# EAGLE design active-multiples (EAGLE 9.2.2)
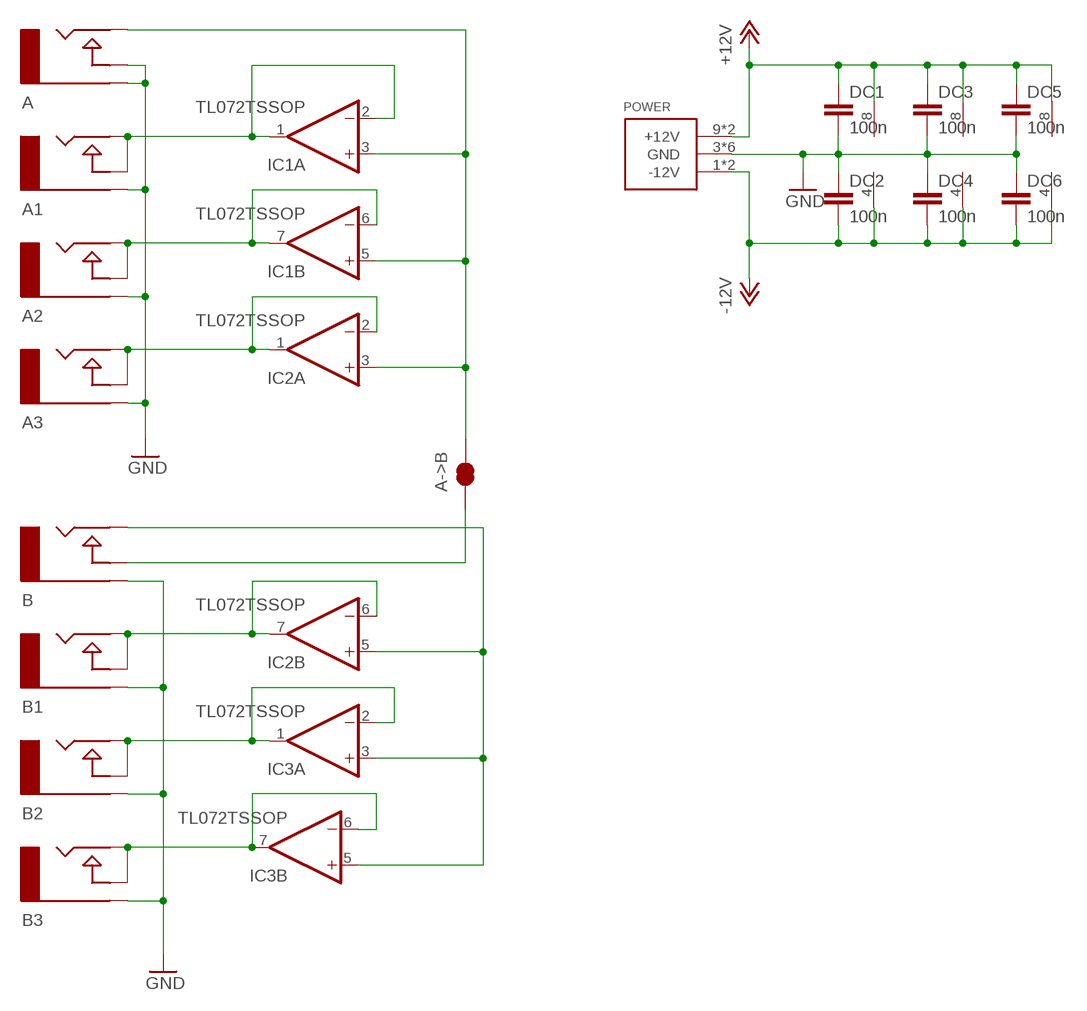
[diagram p0: schematic, sheet 1]

## Parts
A  AUDIO-JACKINLINE  [ERTHENVAR-JACK-INLINE]
A1  AUDIO-JACKINLINE  [ERTHENVAR-JACK-INLINE]
A2  AUDIO-JACKINLINE  [ERTHENVAR-JACK-INLINE]
A3  AUDIO-JACKINLINE  [ERTHENVAR-JACK-INLINE]
A->B  JUMPER-PAD-2-NC_BY_TRACENO_SILK  [PAD-JUMPER-2-NC_BY_TRACE_NO_SILK]
B  AUDIO-JACKINLINE  [ERTHENVAR-JACK-INLINE]
B1  AUDIO-JACKINLINE  [ERTHENVAR-JACK-INLINE]
B2  AUDIO-JACKINLINE  [ERTHENVAR-JACK-INLINE]
B3  AUDIO-JACKINLINE  [ERTHENVAR-JACK-INLINE]
DC1  100n  CAP0603-CAP  [0603-CAP]
DC2  100n  CAP0603-CAP  [0603-CAP]
DC3  100n  CAP0603-CAP  [0603-CAP]
DC4  100n  CAP0603-CAP  [0603-CAP]
DC5  100n  CAP0603-CAP  [0603-CAP]
DC6  100n  CAP0603-CAP  [0603-CAP]
IC1  TL072TSSOP  [TSSOP8]
IC2  TL072TSSOP  [TSSOP8]
IC3  TL072TSSOP  [TSSOP8]
POWER  POWER_SIMPLE10  [POWER_10]

## Nets
+12V: DC1.1 DC3.1 DC5.1 IC1.8(P:V+) IC2.8(P:V+) IC3.8(P:V+) POWER.9(+12V) POWER.10(+12V)
-12V: DC2.2 DC4.2 DC6.2 IC1.4(P:V-) IC2.4(P:V-) IC3.4(P:V-) POWER.1(-12V) POWER.2(-12V)
GND: A1.G(RING) A2.G(RING) A3.G(RING) A.G(RING) A.N(NORM) B1.G(RING) B2.G(RING) B3.G(RING) B.G(RING) DC1.2 DC2.1 DC3.2 DC4.1 DC5.2 DC6.1 POWER.3(GND) POWER.4(GND) POWER.5(GND) POWER.6(GND) POWER.7(GND) POWER.8(GND)
N$1: A1.N(NORM) A1.T(TIP) IC1.1(A:OUT) IC1.2(A:-IN)
N$2: A->B.1 B.N(NORM)
N$3: A3.N(NORM) A3.T(TIP) IC2.1(A:OUT) IC2.2(A:-IN)
N$4: A2.N(NORM) A2.T(TIP) IC1.6(B:-IN) IC1.7(B:OUT)
N$10: A->B.2 A.T(TIP) IC1.3(A:+IN) IC1.5(B:+IN) IC2.3(A:+IN)
N$11: B1.N(NORM) B1.T(TIP) IC2.6(B:-IN) IC2.7(B:OUT)
N$12: B3.N(NORM) B3.T(TIP) IC3.6(B:-IN) IC3.7(B:OUT)
N$13: B.T(TIP) IC2.5(B:+IN) IC3.3(A:+IN) IC3.5(B:+IN)
N$15: B2.N(NORM) B2.T(TIP) IC3.1(A:OUT) IC3.2(A:-IN)

## Library data of the parts
A A1-A3 B B1-B3 = erthenvar:AUDIO-JACK: Switching Mono 3.5mm Audio Jack from Erthenvar. Horizontal package.
A->B = SparkFun-Passives:JUMPER-PAD-2-NC_BY_TRACE
DC1-DC6 = SparkFun-Passives:CAP: Capacitor Standard 0603 ceramic capacitor, and 0.1" leaded capacitor.
IC1-IC3 = linear:TL072: OP AMP
POWER = eurorack:POWER_SIMPLE

## Board
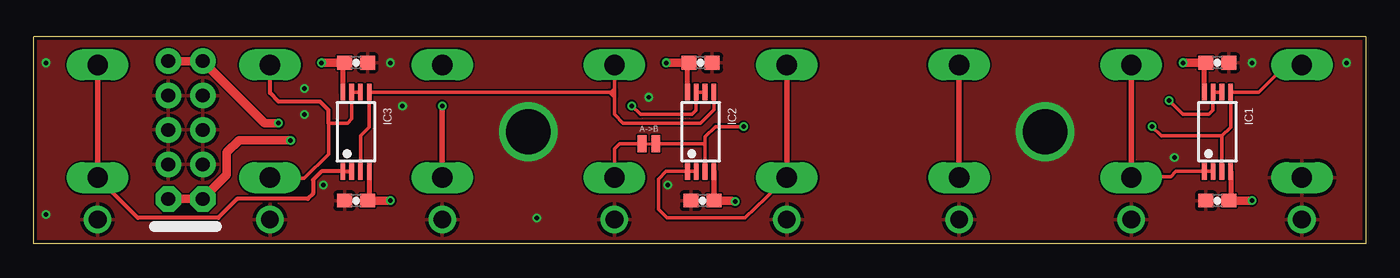
[diagram p1: board, top side]
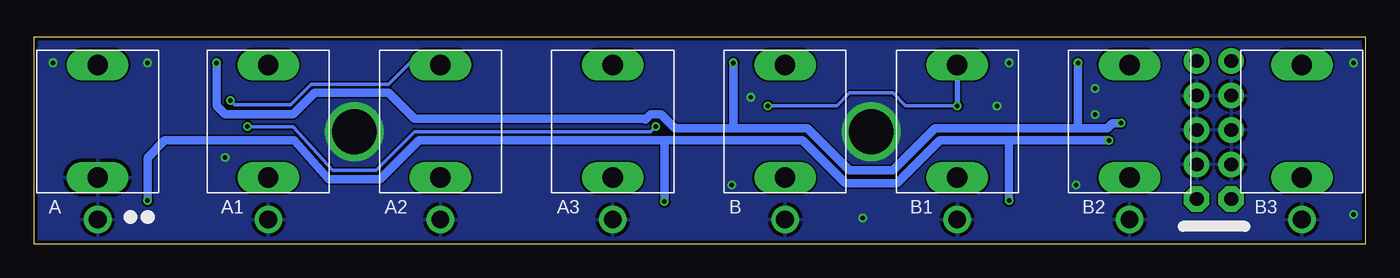
[diagram p2: board, bottom side, seen from below]

Size 98.17 x 15.24 mm. Coordinates in mm from the lower left corner, seen from the top.
Outline: 98.17,0 0,0 0,15.24 98.17,15.24 98.17,0
Copper layers (1*16): Top 0.035mm / dielectric 1.5mm / Bottom 0.035mm
Design rules "dirt_cheap_dirty_boards.v1": minimum track width 5mil, minimum drill 12mil, track to track 5mil, track to pad 5mil, pad to pad 5mil, via to via 5mil, smd to smd 0mil, copper to edge 10mil, drill to drill 10mil, minimum pad ring 10mil, minimum via ring 6mil, stop-mask expansion 2mil, vias tented up to drill 25mil, thermal gap 10mil

### Footprints (pad centres in the part's own frame; a part is rotated, then mirrored left to right if it is on the bottom)
ERTHENVAR-JACK-INLINE = drill 1.3 pad 2.032: G 0,-6.48 | drill 1.5 pad 2.286 long: N 0,-3.38; T 0,4.92
PAD-JUMPER-2-NC_BY_TRACE_NO_SILK = smd 0.635 x 1.27: 1 -0.508,0; 2 0.508,0
0603-CAP = smd 1.1 x 1: 1 -0.85,0; 2 0.85,0
TSSOP8 = smd 0.35 x 1.2: 1 -0.975,-2.925; 2 -0.325,-2.925; 3 0.325,-2.925; 4 0.975,-2.925; 5 0.975,2.925; 6 0.325,2.925; 7 -0.325,2.925; 8 -0.975,2.925
POWER_10 = drill 1.016 pad 1.88 octagon: 1 -5.08,-1.27; 2 -5.08,1.27 | drill 1.016 pad 1.88: 3 -2.54,-1.27; 4 -2.54,1.27; 5 0,-1.27; 6 0,1.27; 7 2.54,-1.27; 8 2.54,1.27; 9 5.08,-1.27; 10 5.08,1.27

### Placement (x,y rotation side)
A  93.47,8.26 0 bottom
A1  80.9,8.26 0 bottom
A2  68.2,8.26 0 bottom
A3  55.5,8.26 0 bottom
A->B  45.34,7.37 0 top
B  42.8,8.26 0 bottom
B1  30.1,8.26 0 bottom
B2  4.7,8.26 0 bottom
B3  17.4,8.26 0 bottom
DC1  87.25,13.33 0 top
DC2  87.25,3.17 0 top
DC3  49.15,13.33 0 top
DC4  49.28,3.17 0 top
DC5  23.75,13.33 0 top
DC6  23.75,3.17 0 top
IC1  87.25,8.26 0 top
IC2  49.15,8.26 0 top
IC3  23.75,8.26 0 top
POWER  11.18,8.38 90 top

### Tracks (layer width: path | path; a pad name or v marks a point on that pad's centre or on a via)
+12V  (via drill 0.33)
  Top 0.356: IC3.8 22.77,13.21 DC5.1 | IC2.8 48.17,13.34 DC3.1 | IC1.8 86.27,13.34 DC1.1
  Top 0.61: v46.61,13.33 DC3.1 | v84.71,13.33 DC1.1 | v21.21,13.33 DC5.1 | v18.03,8.89 17.02,8.89 POWER.9 POWER.10
  Bottom 0.61: 21.21,8.51 19.05,8.51 18.67,8.89 v18.03,8.89 | 46.61,8.64 46.61,8.51 41.15,8.51 38.04,5.4 34.86,5.4 31.75,8.51 21.21,8.51 | 46.61,8.64 46.74,8.51 50.93,8.51 51.94,9.53 52.7,9.53 53.09,9.14 53.15,9.21 70.1,9.21 72.01,11.11 77.47,11.11 79.06,9.53 84.07,9.53 84.71,10.16 v84.71,13.33 | 46.61,8.64 v46.61,13.33 | 21.21,8.51 v21.21,13.33
-12V  (via drill 0.33)
  Top 0.356: IC3.4 24.72,3.3 DC6.2 | IC1.4 88.22,3.3 DC2.2
  Top 0.406: IC2.4 DC4.2
  Top 0.61: DC2.2 v89.79,3.17 | v26.29,3.17 DC6.2 | DC4.2 51.43,3.17 v51.69,3.11 | POWER.2 POWER.1 14.22,5.08 14.22,6.73 15.11,7.62 v18.92,7.62
  Bottom 0.61: v89.79,3.17 89.79,6.35 88.52,7.62 78.99,7.62 76.45,4.76 72.64,4.76 69.79,7.62 51.69,7.62 | v18.92,7.62 26.29,7.62 | 26.29,7.62 v26.29,3.17 | v51.69,3.11 51.69,7.62 | 51.69,7.62 41.53,7.62 38.35,4.45 34.54,4.45 31.37,7.62 26.29,7.62
GND  (via drill 0.33, 3.3)
  other vias: 37.08,1.91 89.79,13.33 26.29,13.33 96.77,13.33 0.89,13.33 46.74,4.32 21.34,4.32 27.18,10.16 0.89,2.16 84.07,6.35 19.94,9.53 74.55,8.26 36.45,8.26 19.94,11.43 45.34,10.79
  pour Top: -0.38,15.24 98.68,15.24 98.68,0 -0.38,0
  pour Bottom: -0.38,15.24 98.68,15.24 98.68,0 -0.38,0
N$1
  Top 0.254: IC1.2 IC1.1 84.2,5.33 83.82,4.95 80.98,4.95 A1.N
  Top 0.406: A1.N A1.T
N$2
  Top 0.254: A->B.1 43.18,7.37 42.8,6.98 B.N
N$3
  Top 0.254: IC2.1 IC2.2 46.6,5.33 46.04,4.76 46.04,2.54 46.67,1.91 52.4,1.91 A3.N
  Top 0.406: A3.N A3.T
N$4  (via drill 0.33)
  Top 0.254: IC1.6 IC1.7 86.92,9.83 86.61,9.53 84.71,9.53 v83.69,10.54
  Top 0.406: A2.T A2.N
  Bottom 0.254: A2.T 68.29,13.08 68.55,13.33 70.42,13.33 72.01,11.75 77.72,11.75 79.25,10.22 83.38,10.22 v83.69,10.54
N$10  (via drill 0.33)
  Top 0.254: A.T 93.38,13.08 92.2,13.08 90.3,11.18 IC1.5 88.22,8.6 87.57,7.94 | IC1.3 87.57,7.94 | 87.57,7.94 83.11,7.94 v82.42,8.64 | v52.32,8.64 50.24,8.64 49.47,7.87 49.47,7.36 | A->B.2 49.47,7.37 49.47,7.36 | 49.47,7.36 IC2.3
  Bottom 0.254: v82.42,8.64 79.06,8.64 76.14,5.4 72.96,5.4 70.1,8.26 52.7,8.26 v52.32,8.64
N$11  (via drill 0.33)
  Top 0.254: IC2.6 IC2.7 48.82,9.83 48.51,9.53 44.7,9.53 v44.07,10.16
  Top 0.406: B1.N v30.1,10.16
  Bottom 0.254: v44.07,10.16 38.99,10.16 38.04,11.11 34.86,11.11 33.91,10.16 v30.1,10.16
  Bottom 0.406: v30.1,10.16 B1.T
N$12
  Top 0.254: IC3.6 IC3.7 23.42,9.2 23.11,8.89 21.72,8.89 21.72,6.6 19.94,4.83 17.45,4.83 B3.N
  Top 0.305: 21.72,8.89 21.72,9.84 21.08,10.48 18.03,10.48 17.4,11.11 B3.T
N$13
  Top 0.254: IC2.5 50.12,9.87 49.15,8.89 43.43,8.89 42.8,9.53 42.8,10.79 | 42.8,10.79 42.42,11.18 | 42.42,11.18 42.41,11.18 | 42.41,11.18 IC3.5 24.72,8.6 24.07,7.94 IC3.3 | 42.41,11.18 42.79,11.18 42.8,11.18 | 42.8,11.18 42.8,10.79 | 42.8,11.18 42.54,11.18 | 42.42,11.18 42.54,11.18 | 42.54,11.18 42.8,11.43 | 42.8,11.43 42.8,11.18 | 42.8,11.43 B.T
N$15
  Top 0.305: IC3.2 IC3.1 21.21,5.33 20.57,4.7 20.57,3.68 20.19,3.3 14.99,3.3 13.59,1.91 7.67,1.91 B2.N
  Top 0.406: B2.N B2.T

### Text on the board
bPlace: B3 | B2 | B1 | B | A3 | A2 | A1 | A
bStop: Multiples / rev A
Reference: 8HP | 6HP